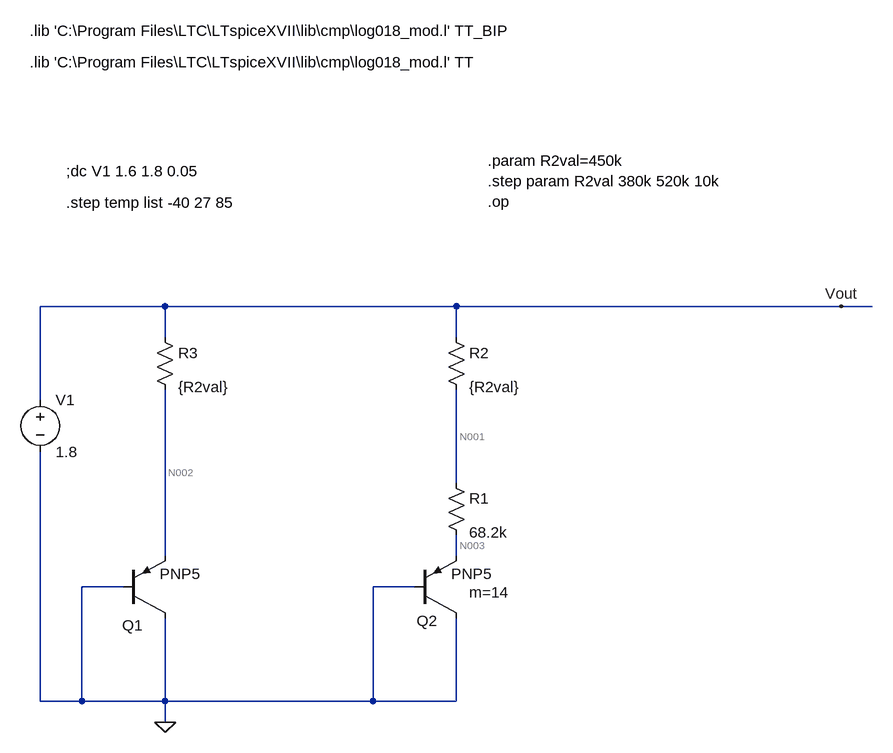
[diagram p0: schematic SPICE_RESIT.asc]
SPICE_RESIT.asc, the LTspice schematic file:
Version 4
SHEET 1 2248 1144
WIRE 400 0 208 0
WIRE 848 0 400 0
WIRE 1440 0 848 0
WIRE 1488 0 1440 0
WIRE 400 48 400 0
WIRE 848 48 848 0
WIRE 208 144 208 0
WIRE 848 272 848 128
WIRE 400 384 400 128
WIRE 848 384 848 352
WIRE 336 432 272 432
WIRE 784 432 720 432
WIRE 208 608 208 224
WIRE 272 608 272 432
WIRE 272 608 208 608
WIRE 400 608 400 480
WIRE 400 608 272 608
WIRE 720 608 720 432
WIRE 720 608 400 608
WIRE 848 608 848 480
WIRE 848 608 720 608
WIRE 400 640 400 608
FLAG 400 640 0
FLAG 1440 0 Vout
SYMBOL pnp2 336 480 M180
WINDOW 0 -2 -11 Left 2
SYMATTR InstName Q1
SYMATTR Value PNP5
SYMBOL pnp2 784 480 M180
WINDOW 123 84 40 Left 2
WINDOW 0 3 -4 Left 2
SYMATTR Value2 m=14
SYMATTR InstName Q2
SYMATTR Value PNP5
SYMBOL res 832 256 R0
WINDOW 3 36 92 Left 2
SYMATTR Value 68.2k
SYMATTR InstName R1
SYMBOL res 832 32 R0
WINDOW 3 36 92 Left 2
SYMATTR Value {R2val}
SYMATTR InstName R2
SYMBOL res 384 32 R0
WINDOW 3 36 92 Left 2
SYMATTR Value {R2val}
SYMATTR InstName R3
SYMBOL voltage 208 128 R0
WINDOW 123 0 0 Left 0
WINDOW 39 0 0 Left 0
SYMATTR InstName V1
SYMATTR Value 1.8
TEXT 248 -160 Left 2 !.step temp list -40 27 85
TEXT 192 -376 Left 2 !.lib 'C:\\Program Files\\LTC\\LTspiceXVII\\lib\\cmp\\log018_mod.l' TT
TEXT 192 -424 Left 2 !.lib 'C:\\Program Files\\LTC\\LTspiceXVII\\lib\\cmp\\log018_mod.l' TT_BIP
TEXT 248 -208 Left 2 !;dc V1 1.6 1.8 0.05
TEXT 896 -224 Left 2 !.param R2val=450k\n.step param R2val 380k 520k 10k\n.op

The netlist it stands for:
* SPICE_RESIT.asc
Q1 0 0 N002 0 PNP5
Q2 0 0 N003 0 PNP5 m=14
R1 N001 N003 68.2k
R2 Vout N001 {R2val}
R3 Vout N002 {R2val}
V1 Vout 0 1.8
.model NPN NPN
.model PNP PNP
.lib standard.bjt
.step temp list -40 27 85
.lib 'C:\Program Files\LTC\LTspiceXVII\lib\cmp\log018_mod.l' TT
.lib 'C:\Program Files\LTC\LTspiceXVII\lib\cmp\log018_mod.l' TT_BIP
;dc V1 1.6 1.8 0.05
.param R2val=450k
.step param R2val 380k 520k 10k
.op
.backanno
.end

* Results of the author's LTspice run, read from the files saved beside the schematic
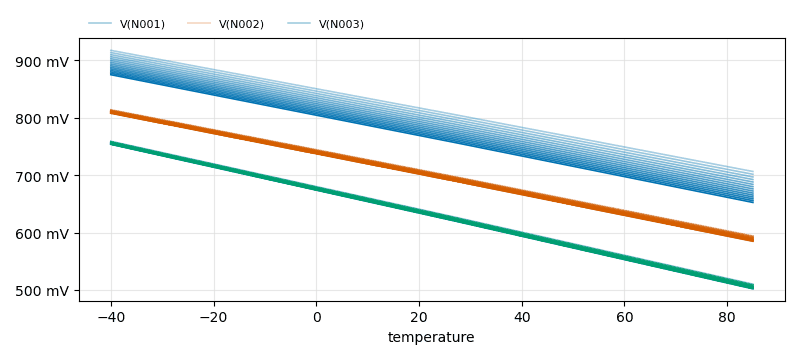
[diagram p1: Operating Point of SPICE_RESIT.asc, plotted from the saved traces]
* Operating Point, 15 runs:
*   V(N001) [r2val=380000]: 917.5 mV at temperature=-40 , 706.5 mV at temperature=85 , min 706.5 mV, max 917.5 mV
*   V(N001) [r2val=390000]: 913.7 mV at temperature=-40 , 701.6 mV at temperature=85 , min 701.6 mV, max 913.7 mV
*   V(N001) [r2val=400000]: 910 mV at temperature=-40 , 697 mV at temperature=85 , min 697 mV, max 910 mV
*   V(N001) [r2val=410000]: 906.5 mV at temperature=-40 , 692.5 mV at temperature=85 , min 692.5 mV, max 906.5 mV
*   V(N001) [r2val=420000]: 903.1 mV at temperature=-40 , 688.2 mV at temperature=85 , min 688.2 mV, max 903.1 mV
*   V(N001) [r2val=430000]: 899.8 mV at temperature=-40 , 684 mV at temperature=85 , min 684 mV, max 899.8 mV
*   V(N001) [r2val=440000]: 896.7 mV at temperature=-40 , 680 mV at temperature=85 , min 680 mV, max 896.7 mV
*   V(N001) [r2val=450000]: 893.7 mV at temperature=-40 , 676.2 mV at temperature=85 , min 676.2 mV, max 893.7 mV
*   V(N002) [r2val=380000]: 814.1 mV at temperature=-40 , 594.3 mV at temperature=85 , min 594.3 mV, max 814.1 mV
*   V(N002) [r2val=390000]: 813.6 mV at temperature=-40 , 593.5 mV at temperature=85 , min 593.5 mV, max 813.6 mV
*   V(N002) [r2val=400000]: 813.1 mV at temperature=-40 , 592.7 mV at temperature=85 , min 592.7 mV, max 813.1 mV
*   V(N002) [r2val=410000]: 812.6 mV at temperature=-40 , 592 mV at temperature=85 , min 592 mV, max 812.6 mV
*   V(N002) [r2val=420000]: 812.1 mV at temperature=-40 , 591.3 mV at temperature=85 , min 591.3 mV, max 812.1 mV
*   V(N002) [r2val=430000]: 811.7 mV at temperature=-40 , 590.6 mV at temperature=85 , min 590.6 mV, max 811.7 mV
*   V(N002) [r2val=440000]: 811.2 mV at temperature=-40 , 589.9 mV at temperature=85 , min 589.9 mV, max 811.2 mV
*   V(N002) [r2val=450000]: 810.8 mV at temperature=-40 , 589.2 mV at temperature=85 , min 589.2 mV, max 810.8 mV
*   V(N003) [r2val=380000]: 759.1 mV at temperature=-40 , 510.2 mV at temperature=85 , min 510.2 mV, max 759.1 mV
*   V(N003) [r2val=390000]: 758.7 mV at temperature=-40 , 509.5 mV at temperature=85 , min 509.5 mV, max 758.7 mV
*   V(N003) [r2val=400000]: 758.3 mV at temperature=-40 , 508.9 mV at temperature=85 , min 508.9 mV, max 758.3 mV
*   V(N003) [r2val=410000]: 757.9 mV at temperature=-40 , 508.3 mV at temperature=85 , min 508.3 mV, max 757.9 mV
*   V(N003) [r2val=420000]: 757.5 mV at temperature=-40 , 507.6 mV at temperature=85 , min 507.6 mV, max 757.5 mV
*   V(N003) [r2val=430000]: 757.1 mV at temperature=-40 , 507 mV at temperature=85 , min 507 mV, max 757.1 mV
*   V(N003) [r2val=440000]: 756.7 mV at temperature=-40 , 506.4 mV at temperature=85 , min 506.4 mV, max 756.7 mV
*   V(N003) [r2val=450000]: 756.3 mV at temperature=-40 , 505.8 mV at temperature=85 , min 505.8 mV, max 756.3 mV
* From the log:
*   Semiconductor Device Operating Points:
*                           --- Bipolar Transistors ---
*   Name:       q2          q1
*   Model:     pnp5        pnp5
*   Ib:      -6.33e-07   -7.09e-07
*   Ic:      -1.69e-06   -1.89e-06
*   Vbe:     -7.59e-01   -8.14e-01
*   Vbc:      0.00e+00    0.00e+00
*   Vce:     -7.59e-01   -8.14e-01
*   BetaDC:   2.67e+00    2.66e+00
*   Gm:       8.46e-05    9.42e-05
*   Rpi:      3.15e+04    2.81e+04
*   Rx:       3.53e+00    4.94e+01
*   Ro:       2.13e+08    1.90e+08
*   Cbe:      4.19e-14    4.27e-14
*   Cbc:      3.64e-14    3.64e-14
*   Cjs:      0.00e+00    0.00e+00
*   BetaAC:   2.67e+00    2.65e+00
*   Cbx:      0.00e+00    0.00e+00
*   Ft:       1.59e+08    1.76e+08